# Altium schematic sheet ADC_RS_MCU.SchDoc
size A0; SheetNumber: 1; SheetTotal: 1
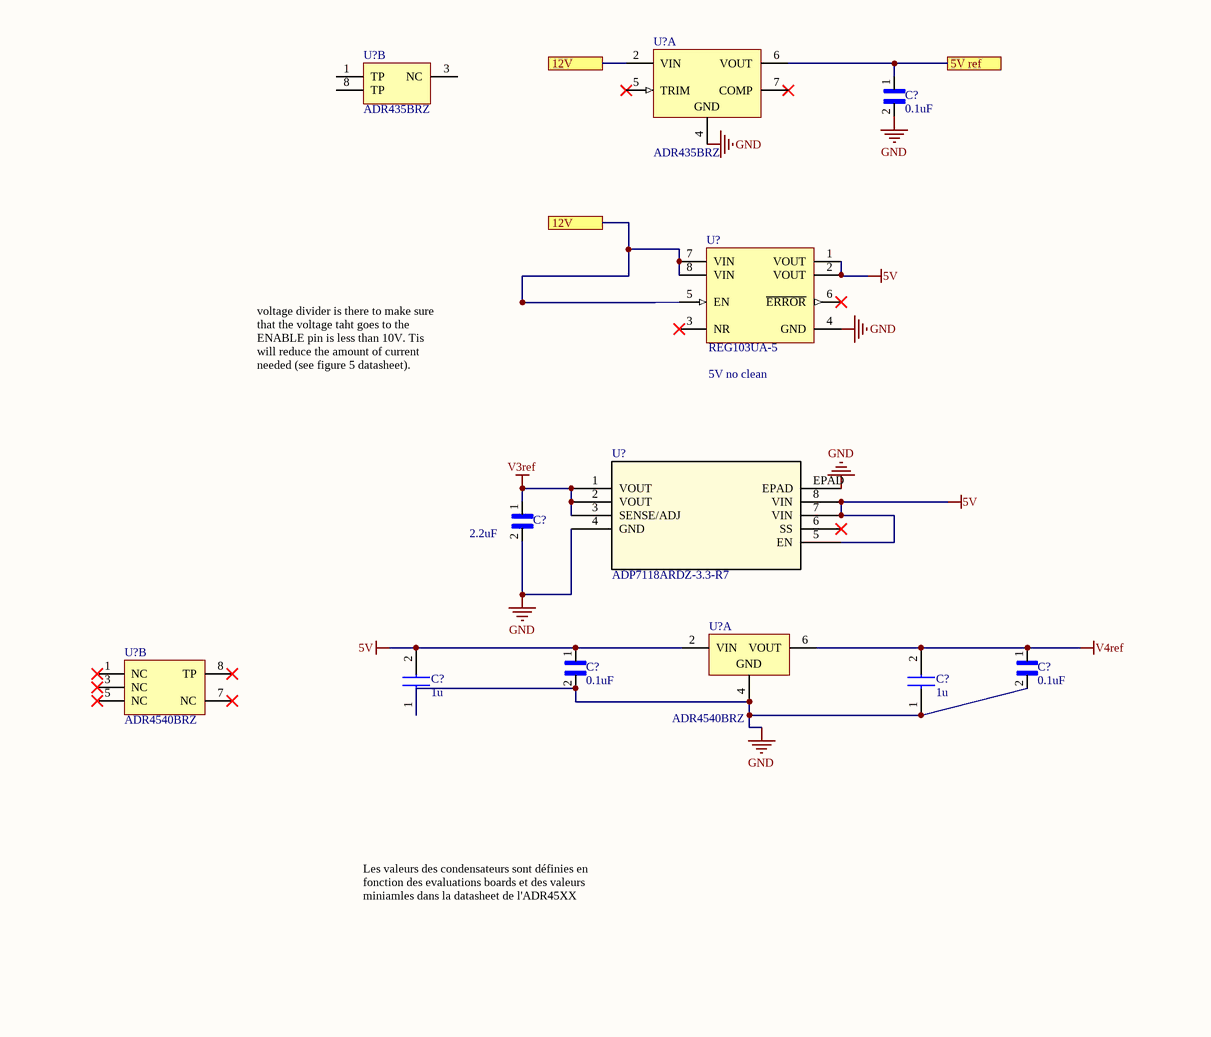
[diagram p0: ADC_RS_MCU.SchDoc, top left]
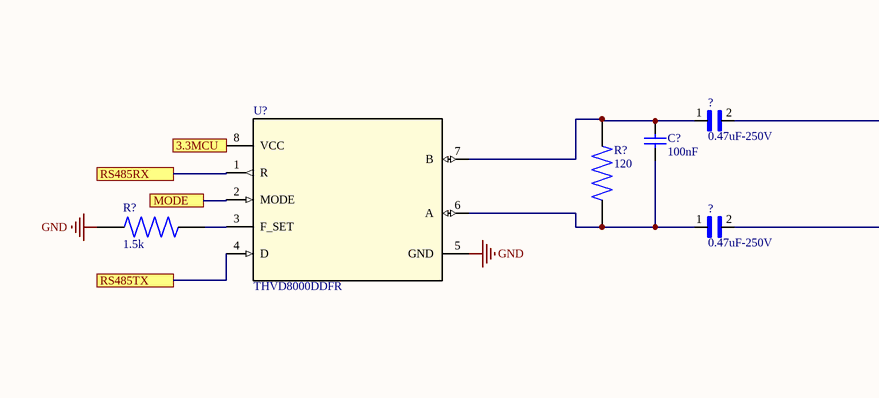
[diagram p1: ADC_RS_MCU.SchDoc, top middle]
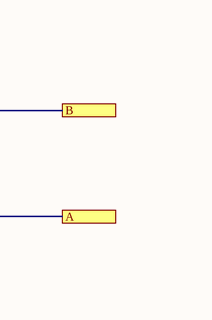
[diagram p2: ADC_RS_MCU.SchDoc, top right]
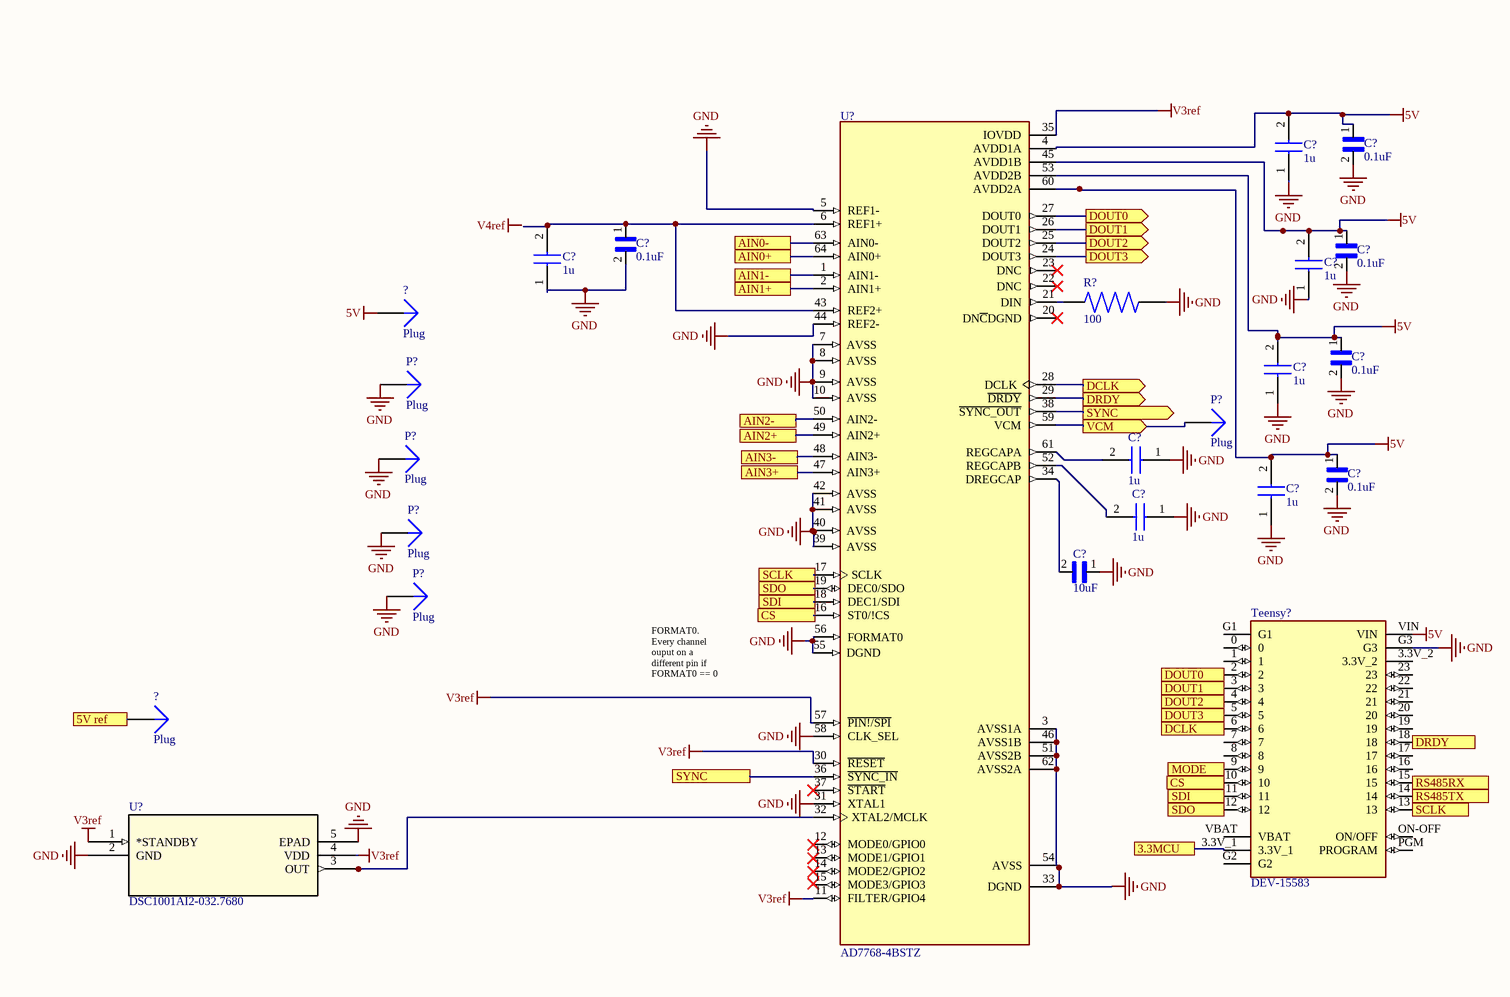
[diagram p3: ADC_RS_MCU.SchDoc, bottom left]
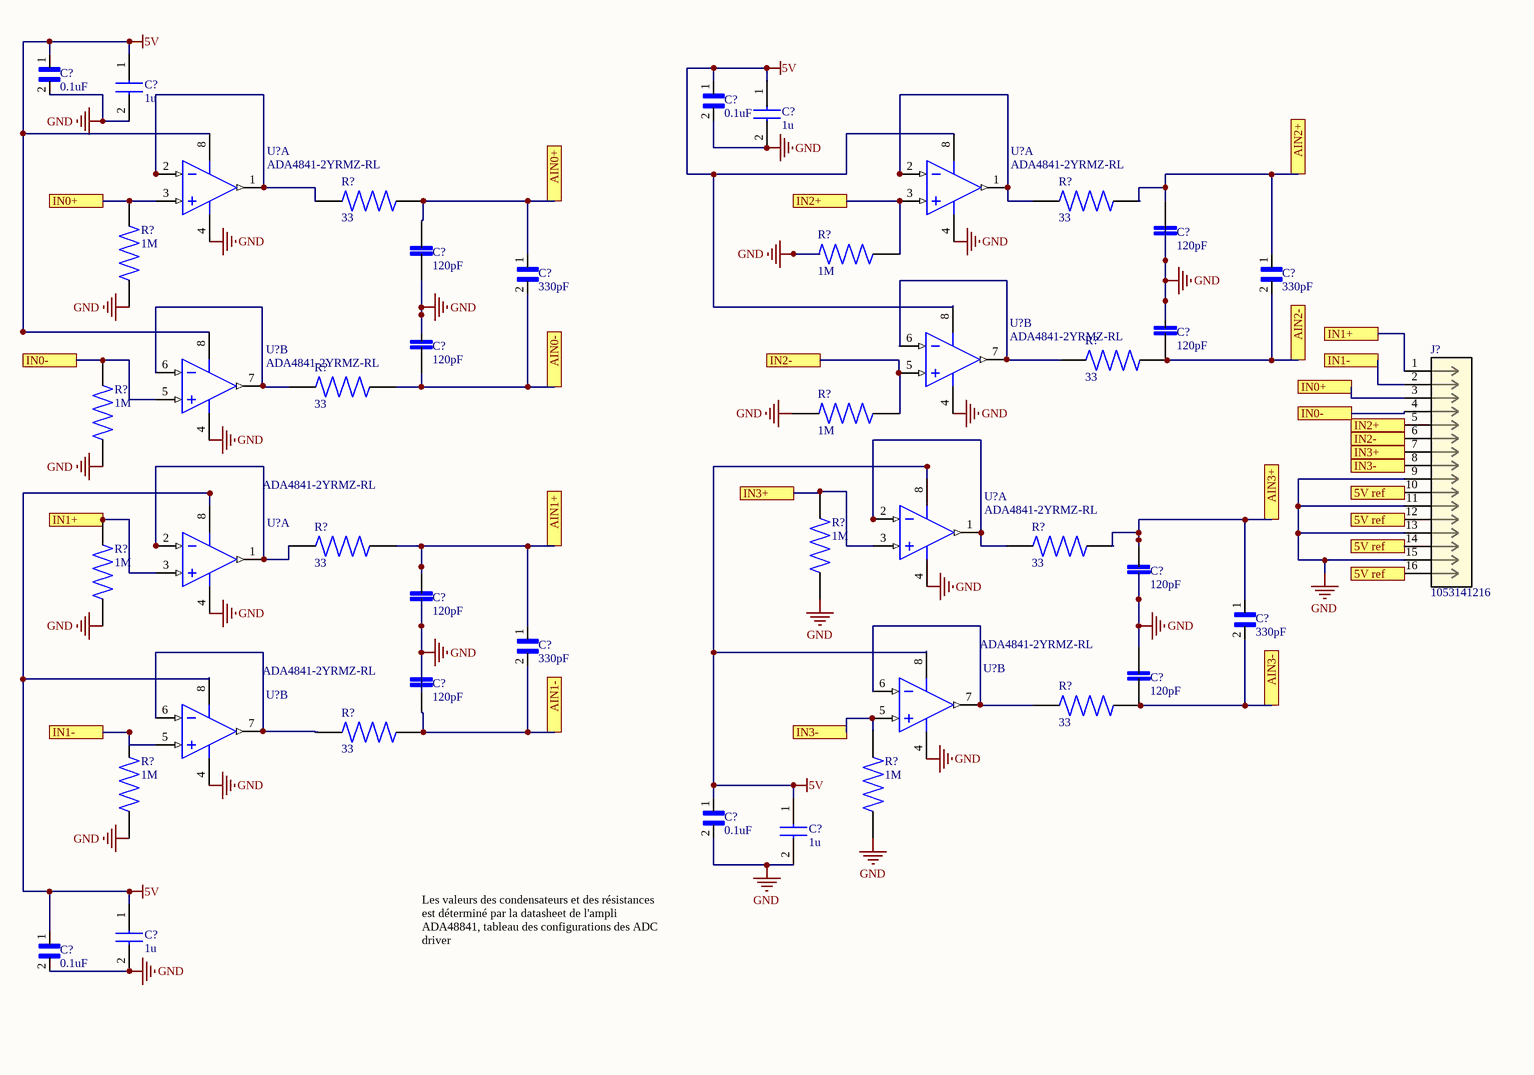
[diagram p4: ADC_RS_MCU.SchDoc, bottom right]

## Parts
(Parts that share a designator on the sheet are numbered #1, #2 ... from top to bottom, then left to right.)
?#1  0.47uF-250V  [CAPC3326X280N]
?#2  0.47uF-250V  [CAPC3326X280N]
?#3  Plug  [PIN1]
?#4  Plug  [PIN1]
C?#1  0.1uF  [CAPC1608X90N]
C?#2  100nF  [CAPC3216X94X50ML20T25]
C?#3  2.2uF  [CAPC1608X90]
C?#4  0.1uF  [CAPC1608X90N]
C?#5  0.1uF  [CAPC1608X90N]
C?#6  1u  [CAPC1608X90N]
C?#7  1u  [CAPC1608X90N]
C?#8  1u  [CAPC1608X90N]
C?#9  0.1uF  [CAPC1608X90N]
C?#10  1u  [CAPC1608X90N]
C?#11  0.1uF  [CAPC1608X90N]
C?#12  120pF  [CAPC1608X90]
C?#13  120pF  [CAPC1608X90]
C?#14  330pF  [CAPC1608X90]
C?#15  330pF  [CAPC1608X90]
C?#16  120pF  [CAPC1608X90]
C?#17  120pF  [CAPC1608X90]
C?#18  120pF  [CAPC1608X90]
C?#19  120pF  [CAPC1608X90]
C?#20  330pF  [CAPC1608X90]
C?#21  330pF  [CAPC1608X90]
C?#22  120pF  [CAPC1608X90]
C?#23  120pF  [CAPC1608X90]
C?#24  1u  [CAPC1608X90N]
C?#25  0.1uF  [CAPC1608X90N]
C?#26  0.1uF  [CAPC1608X90N]
C?#27  1u  [CAPC1608X90N]
C?#28  0.1uF  [CAPC1608X90N]
C?#29  1u  [CAPC1608X90N]
C?#30  0.1uF  [CAPC1608X90N]
C?#31  0.1uF  [CAPC1608X90N]
C?#32  1u  [CAPC1608X90N]
C?#33  1u  [CAPC1608X90N]
C?#34  0.1uF  [CAPC1608X90N]
C?#35  1u  [CAPC1608X90N]
C?#36  1u  [CAPC1608X90N]
C?#37  0.1uF  [CAPC1608X90N]
C?#38  1u  [CAPC1608X90N]
C?#39  1u  [CAPC1608X90N]
C?#40  10uF  [CAPC1608X9N]
J?  1053141216  [CON_1053141216]
P?#1  Plug  [PIN1]
P?#2  Plug  [PIN1]
P?#3  Plug  [PIN1]
P?#4  Plug  [PIN1]
P?#5  Plug  [PIN1]
R?#1  120  [RES_ERA3AEB121V]
R?#2  1.5k  [RESC1608X55N]
R?#3  33  [RESC1608X55N]
R?#4  33  [RESC1608X55N]
R?#5  1M  [RESC1608X55N]
R?#6  1M  [RESC1608X55N]
R?#7  33  [RESC1608X55N]
R?#8  33  [RESC1608X55N]
R?#9  1M  [RESC1608X55N]
R?#10  1M  [RESC1608X55N]
R?#11  33  [RESC1608X55N]
R?#12  1M  [RESC1608X55N]
R?#13  33  [RESC1608X55N]
R?#14  1M  [RESC1608X55N]
R?#15  33  [RESC1608X55N]
R?#16  33  [RESC1608X55N]
R?#17  1M  [RESC1608X55N]
R?#18  1M  [RESC1608X55N]
R?#19  100  [RESC1508X55N]
Teensy?  DEV-15583  [MODULE_DEV-15583]
U?#1  ADR435BRZ  [ADI-R-8_M]  (part A of 2)
U?#2  ADR435BRZ  [ADI-R-8_M]  (part B of 2)
U?#3  THVD8000DDFR  [DDF0008A-IPC_A]
U?#4  REG103UA-5  [D0008A_M]
U?#5  ADP7118ARDZ-3.3-R7  [SOIC_08_EP_3P9X4P9_ADI]
U?#6  ADR4540BRZ  [ADI-R-8_M]  (part A of 2)
U?#7  ADR4540BRZ  [ADI-R-8_M]  (part B of 2)
U?#8  ADA4841-2YRMZ-RL  [ADI-RM-8_M]  (part A of 2)
U?#9  ADA4841-2YRMZ-RL  [ADI-RM-8_M]  (part A of 2)
U?#10  ADA4841-2YRMZ-RL  [ADI-RM-8_M]  (part B of 2)
U?#11  ADA4841-2YRMZ-RL  [ADI-RM-8_M]  (part B of 2)
U?#12  ADA4841-2YRMZ-RL  [ADI-RM-8_M]  (part A of 2)
U?#13  ADA4841-2YRMZ-RL  [ADI-RM-8_M]  (part A of 2)
U?#14  ADA4841-2YRMZ-RL  [ADI-RM-8_M]  (part B of 2)
U?#15  ADA4841-2YRMZ-RL  [ADI-RM-8_M]  (part B of 2)
U?#16  AD7768-4BSTZ
U?#17  DSC1001AI2-032.7680  [DFN4_7X5_MCH]

## Ports
3.3MCU, 5V ref, 12V, A, AIN0+, AIN0-, AIN1+, AIN1-, AIN2+, AIN2-, AIN3+, AIN3-, B, CS, DCLK (out), DOUT0 (out), DOUT1 (out), DOUT2 (out), DOUT3 (out), DRDY (out), IN0+, IN0-, IN1+, IN1-, IN2+, IN2-, IN3+, IN3-, MODE, RS485RX, RS485TX, SCLK, SDI, SDO, SYNC, SYNC (out), VCM (out)

## Nets
5V: ?#3.1 C?#4.1 C?#6.2 C?#8.1 C?#9.1 C?#10.1 C?#11.1 C?#24.1 C?#25.1 C?#26.1 C?#27.2 C?#29.1 C?#30.1 C?#31.1 C?#33.2 C?#34.1 C?#35.2 C?#37.1 C?#39.2 Teensy?.VIN U?#4.1(VOUT) U?#4.2(VOUT) U?#5.5(EN) U?#5.7(VIN) U?#5.8(VIN) U?#6.2(VIN) U?#8.8(+VS) U?#9.8(+VS) U?#10.8(+VS) U?#11.8(+VS) U?#12.8(+VS) U?#13.8(+VS) U?#14.8(+VS) U?#15.8(+VS) U?#16.4(AVDD1A) U?#16.45(AVDD1B) U?#16.53(AVDD2B) U?#16.60(AVDD2A)
GND: C?#1.2 C?#3.2 C?#4.2 C?#5.2 C?#6.1 C?#7.1 C?#8.2 C?#9.2 C?#10.2 C?#11.2 C?#12.1 C?#13.1 C?#16.2 C?#17.2 C?#18.1 C?#19.1 C?#22.2 C?#23.2 C?#24.2 C?#25.2 C?#26.2 C?#27.1 C?#28.2 C?#29.2 C?#30.2 C?#31.2 C?#32.1 C?#33.1 C?#34.2 C?#35.1 C?#36.1 C?#37.2 C?#38.1 C?#39.1 C?#40.1 J?.9 J?.11 J?.13 J?.15 P?#1.1 P?#3.1 P?#4.1 P?#5.1 R?#2.1 R?#5.1 R?#6.2 R?#9.1 R?#10.2 R?#12.1 R?#14.1 R?#17.1 R?#18.1 R?#19.2 Teensy?.G3 U?#1.4(GND) U?#3.5(GND) U?#4.4(GND) U?#5.4(GND) U?#5.EPAD U?#6.4(GND) U?#8.4(-VS) U?#9.4(-VS) U?#10.4(-VS) U?#11.4(-VS) U?#12.4(-VS) U?#13.4(-VS) U?#14.4(-VS) U?#15.4(-VS) U?#16.3(AVSS1A) U?#16.5(REF1-) U?#16.7(AVSS) U?#16.8(AVSS) U?#16.9(AVSS) U?#16.10(AVSS) U?#16.31(XTAL1) U?#16.33(DGND) U?#16.39(AVSS) U?#16.40(AVSS) U?#16.41(AVSS) U?#16.42(AVSS) U?#16.44(REF2-) U?#16.46(AVSS1B) U?#16.51(AVSS2B) U?#16.54(AVSS) U?#16.55(DGND) U?#16.56(FORMAT0) U?#16.58(CLK_SEL) U?#16.62(AVSS2A) U?#17.2(GND) U?#17.5(EPAD)
V3ref: C?#3.1 U?#5.1(VOUT) U?#5.2(VOUT) U?#5.3(SENSE/ADJ) U?#16.11(FILTER/GPIO4) U?#16.30(~{RESET}) U?#16.35(IOVDD) U?#16.57(~{PIN!/SPI}) U?#17.1(*STANDBY) U?#17.4(VDD)
V4ref: C?#5.1 C?#7.2 U?#6.6(VOUT)
3.3MCU: Teensy?.3.3V_1 U?#3.8(VCC) ; port 3.3MCU
5V ref: ?#4.1 C?#1.1 J?.10 J?.12 J?.14 J?.16 U?#1.6(VOUT) ; port 5V ref
12V: U?#1.2(VIN) U?#4.5(EN) U?#4.7(VIN) U?#4.8(VIN) ; port 12V
A: ?#2.2 ; port A
AIN0+: C?#13.2 C?#14.1 R?#3.2 U?#16.64(AIN0+) ; port AIN0+
AIN0-: C?#14.2 C?#17.1 R?#8.2 U?#16.63(AIN0-) ; port AIN0-
AIN1+: C?#19.2 C?#21.1 R?#11.2 U?#16.2(AIN1+) ; port AIN1+
AIN1-: C?#21.2 C?#23.1 R?#16.2 U?#16.1(AIN1-) ; port AIN1-
AIN2+: C?#12.2 C?#15.1 R?#4.2 U?#16.49(AIN2+) ; port AIN2+
AIN2-: C?#15.2 C?#16.1 R?#7.2 U?#16.50(AIN2-) ; port AIN2-
AIN3+: C?#18.2 C?#20.1 R?#13.2 U?#16.47(AIN3+) ; port AIN3+
AIN3-: C?#20.2 C?#22.1 R?#15.2 U?#16.48(AIN3-) ; port AIN3-
B: ?#1.2 ; port B
CS: Teensy?.10 U?#16.16(ST0/!CS) ; port CS
DCLK: Teensy?.6 U?#16.28(DCLK) ; port DCLK
DOUT0: Teensy?.2 U?#16.27(DOUT0) ; port DOUT0
DOUT1: Teensy?.3 U?#16.26(DOUT1) ; port DOUT1
DOUT2: Teensy?.4 U?#16.25(DOUT2) ; port DOUT2
DOUT3: Teensy?.5 U?#16.24(DOUT3) ; port DOUT3
DRDY: Teensy?.18 U?#16.29(~{DRDY}) ; port DRDY
IN0+: J?.3 R?#5.2 U?#8.3(+IN_1) ; port IN0+
IN0-: J?.4 R?#9.2 U?#11.5(+IN_2) ; port IN0-
IN1+: J?.1 R?#14.2 U?#13.3(+IN_1) ; port IN1+
IN1-: J?.2 R?#17.2 U?#15.5(+IN_2) ; port IN1-
IN2+: J?.5 R?#6.1 U?#9.3(+IN_1) ; port IN2+
IN2-: J?.6 R?#10.1 U?#10.5(+IN_2) ; port IN2-
IN3+: J?.7 R?#12.2 U?#12.3(+IN_1) ; port IN3+
IN3-: J?.8 R?#18.2 U?#14.5(+IN_2) ; port IN3-
MODE: Teensy?.9 U?#3.2(MODE) ; port MODE
RS485RX: Teensy?.15 U?#3.1(R) ; port RS485RX
RS485TX: Teensy?.14 U?#3.4(D) ; port RS485TX
SCLK: Teensy?.13 U?#16.17(SCLK) ; port SCLK
SDI: Teensy?.11 U?#16.18(DEC1/SDI) ; port SDI
SDO: Teensy?.12 U?#16.19(DEC0/SDO) ; port SDO
SYNC: U?#16.36(~{SYNC_IN}) U?#16.38(~{SYNC_OUT}) ; port SYNC
VCM: P?#2.1 U?#16.59(VCM) ; port VCM
Net?#1_1: ?#1.1 C?#2.1 R?#1.2 U?#3.7(B)
Net?#2_1: ?#2.1 C?#2.2 R?#1.1 U?#3.6(A)
NetC?#28_1: C?#28.1 C?#32.2 U?#16.6(REF1+) U?#16.43(REF2+)
NetC?#36_2: C?#36.2 U?#16.61(REGCAPA)
NetC?#38_2: C?#38.2 U?#16.52(REGCAPB)
NetC?#40_2: C?#40.2 U?#16.34(DREGCAP)
NetR?#2_2: R?#2.2 U?#3.3(F_SET)
NetR?#3_1: R?#3.1 U?#8.1(OUT_1) U?#8.2(-IN_1)
NetR?#4_1: R?#4.1 U?#9.1(OUT_1) U?#9.2(-IN_1)
NetR?#7_1: R?#7.1 U?#10.6(-IN_2) U?#10.7(OUT_2)
NetR?#8_1: R?#8.1 U?#11.6(-IN_2) U?#11.7(OUT_2)
NetR?#11_1: R?#11.1 U?#13.1(OUT_1) U?#13.2(-IN_1)
NetR?#13_1: R?#13.1 U?#12.1(OUT_1) U?#12.2(-IN_1)
NetR?#15_1: R?#15.1 U?#14.6(-IN_2) U?#14.7(OUT_2)
NetR?#16_1: R?#16.1 U?#15.6(-IN_2) U?#15.7(OUT_2)
NetR?#19_1: R?#19.1 U?#16.21(DIN)
NetU?#16_32: U?#16.32(XTAL2/MCLK) U?#17.3(OUT)

Not connected (* = marked no-connect by the designer): Teensy? 0 1 3.3V_2 7 8 16 17 19 20 21 22 23 G1 G2 ON-OFF(ON/OFF) PGM(PROGRAM) VBAT; U?#1 5(TRIM)* 7(COMP)*; U?#2 1(TP) 3(NC) 8(TP); U?#4 3(NR)* 6(~{ERROR})*; U?#5 6(SS)*; U?#7 1(NC)* 3(NC)* 5(NC)* 7(NC)* 8(TP)*; U?#16 12(MODE0/GPIO0)* 13(MODE1/GPIO1)* 14(MODE2/GPIO2)* 15(MODE3/GPIO3) 20(DN~{C}DGND)* 22(DNC)* 23(DNC)* 37(~{START})*

## Notes on the sheet
- voltage divider is there to make sure that the voltage taht goes to the ENABLE pin is less than 10V. Tis will reduce the amount of current needed (see figure 5 datasheet).
- (near U?#4) 5V no clean
- Les valeurs des condensateurs sont définies en fonction des evaluations boards et des valeurs miniamles dans la datasheet de l'ADR45XX
- Les valeurs des condensateurs et des résistances est déterminé par la datasheet de l'ampli ADA48841, tableau des configurations des ADC driver
- FORMAT0. Every channel ouput on a different pin if FORMAT0 == 0
- Labels drawn without touching a wire or pin: V4ref

## Library data of the parts
?#1 ?#2 = CMP-010-000002-1: MF: {'manufacturer': u'KEMET'}; MP: C1210X474KARACAUTO; Value: *; Package: None; Price: None; Availability: Unavailable; Component Type: Standard; Design Item ID: C1210X474KARACAUTO; Pin Count: 2; Source: workerBoard.SCHLIB
?#3 ?#4 P?#1-P?#5 = CMP-010-000007-1: Signal Integrity: Connector; LatestRevisionDate: 17-Jul-2002; LatestRevisionNote: Re-released for DXP Platform.; Publisher: Altium Limited; Component Type: Standard; Design Item ID: Plug; Pin Count: 1; Source: workerBoard.SCHLIB
C?#1 C?#4 C?#5 C?#9 C?#11 C?#25 C?#26 C?#28 C?#30 C?#31 C?#34 C?#37 = CMP-003-000001-1: Cap Ceramic 0.1uF 25V X5R 10% SMD 0603 85ÂÂŽ T/R; MF: {'manufacturer': u'AVX'}; Price: None; Availability: Unavailable; Value: *; MP: 06033D104KAT2A; Package: None; Component Type: Standard; Design Item ID: 06033D104KAT2A; Pin Count: 2; Source: workerBoard.SCHLIB
C?#2 = CMP-003-000005-1: Chip Capacitor, Ceramic, 100 nF, 10%, 50 V, 1206, RoHS, Tape and Reel; Manufacturer: Kyocera AVX; Manufacturer Part Number: 12065C104KAT2A; Rated Voltage: 50V; Dielectric: X7R; Datasheet URL: http://www.mouser.com/ds/2/40/cauto-360.pdf; Capacitance: 100nF; Manufacturer URL: http://www.avx.com/; Datasheet Version: Sep-14; Tolerance (%): ±10%; Case Size/Dimension: 1206; Component Type: Standard; Design Item ID: CMP-2000-05018-1; Pin Count: 2; Source: workerBoard.SCHLIB
C?#3 = CMP-003-000006-1: 2.2UF 16V 20%; MP: F981C225MMA; MF: {'manufacturer': u'AVX'}; Package: None; Availability: Unavailable; Value: *; Price: None; Component Type: Standard; Design Item ID: F981C225MMA; Pin Count: 2; Source: workerBoard.SCHLIB
C?#6-C?#8 C?#10 C?#24 C?#27 C?#29 C?#32 C?#33 C?#35 C?#36 C?#38 C?#39 = CMP-003-000003-1: Capacitor; Manufacturer_Name: AVX; Datasheet Link: https://componentsearchengine.com/Datasheets/1/06031A100FAT2A.pdf; Height: 0.9mm; Manufacturer_Part_Number: 0603YC105MAT4A; Component Type: Standard; Design Item ID: 0603YC105MAT4A; Pin Count: 2; Source: workerBoard.SCHLIB
C?#12 C?#13 C?#16-C?#19 C?#22 C?#23 = CMP-003-000002-1: 0603 120 pF 50 V Â±2 % Tolerance C0G/NP0 SMT Multilayer Ceramic Capacitor; MF: {'manufacturer': u'AVX'}; Price: None; Availability: Unavailable; Value: *; MP: 06035A121GAT2A; Package: None; Component Type: Standard; Design Item ID: 06035A121GAT2A; Pin Count: 2; Source: workerBoard.SCHLIB
C?#14 C?#15 C?#20 C?#21 = CMP-003-000000-1: 0603 SMD Ceramic Capacitors 0603 330pF 25volts C0G 2%; MP: 06033A331GAT2A; MF: {'manufacturer': u'AVX'}; Price: None; Availability: Unavailable; Value: *; Package: None; Component Type: Standard; Design Item ID: 06033A331GAT2A; Pin Count: 2; Source: workerBoard.SCHLIB
C?#40 = CMP-003-000008-1: CAP CER 10UF 10V X5R 0603; MP: GRT188R61A106ME13D; MF: {'manufacturer': u'Murata'}; Price: None; Availability: Unavailable; Value: *; Package: None; Component Type: Standard; Design Item ID: GRT188R61A106ME13D; Pin Count: 2; Source: workerBoard.SCHLIB
J? = CMP-010-000000-1: No Description Available; Mfr_Name: Molex Connector Corporation; Copyright: Copyright (C) 2021 Ultra Librarian. All rights reserved.; Manufacturer_Part_Number: 1053141216; Digi-Key_Part_Number_1: WM15165-ND; RefDes: RefDes; Type: DEV; Component Type: Standard; Design Item ID: 1053141216; Pin Count: 16; Source: workerBoard.SCHLIB
R?#1 = CMP-008-000000-1: MP: ERA3AEB121V; MF: {'manufacturer': u'Panasonic'}; Price: None; Availability: Unavailable; Value: *; Package: None; Component Type: Standard; Design Item ID: ERA3AEB121V; Pin Count: 2; Source: workerBoard.SCHLIB
R?#2 = CMP-008-000003-1: MP: RT0603BRD071K5L; MF: {'manufacturer': u'Yageo'}; Price: None; Availability: Unavailable; Value: *; Package: None; Component Type: Standard; Design Item ID: RT0603BRD071K5L; Pin Count: 2; Source: workerBoard.SCHLIB
R?#3 R?#4 R?#7 R?#8 R?#11 R?#13 R?#15 R?#16 = CMP-008-000006-1: RES SMD 33 OHM 0.1% 1/10W 0603; MP: RT0603BRD0733RL; MF: {'manufacturer': u'Yageo'}; Price: None; Availability: Unavailable; Value: *; Package: None; Component Type: Standard; Design Item ID: RT0603BRD0733RL_2; Pin Count: 2; Source: workerBoard.SCHLIB
R?#5 R?#6 R?#9 R?#10 R?#12 R?#14 R?#17 R?#18 = CMP-008-000007-1: MP: RT0603DRD071ML; MF: {'manufacturer': u'Yageo'}; Price: None; Availability: Unavailable; Value: *; Package: None; Component Type: Standard; Design Item ID: RT0603DRD071ML; Pin Count: 2; Source: workerBoard.SCHLIB
R?#19 = CMP-008-000002-1: MP: MCT0603MD1000DP500; MF: {'manufacturer': u'Vishay'}; Price: None; Availability: Unavailable; Value: *; Package: None; Component Type: Standard; Design Item ID: MCT0603MD1000DP500; Pin Count: 2; Source: workerBoard.SCHLIB
Teensy? = CMP-010-000005-1: RT1062 Teensy 4.0 i.MX ARMÂ® CortexÂ®-M7 MPU Embedded Evaluation Board; MF: SparkFun Electronics; Value: *; Package: None; Digi-Key_Part_Number: 1568-DEV-15583-ND; Digi-Key_Purchase_URL: https://www.digikey.com/product-detail/en/sparkfun-electronics/DEV-15583/1568-DEV-15583-ND/10384551?utm_source=snapeda&utm_medium=aggregator&utm_campaign=symbol; MP: DEV-15583; SnapEDA_Link: https://www.snapeda.com/parts/DEV-15583/SparkFun%20Electronics/view-part/4001229/?ref=snap; Component Type: Standard; Design Item ID: DEV-15583; Pin Count: 33; Source: workerBoard.SCHLIB
U?#1 U?#2 = CMP-006-000001-1: Ultralow Noise XFET Voltage Reference with Current Sink and Source Capability, 5 V Output, 7 to 18 V Supply, Industrial, 8-pin SOIC (R-8), Tube; Manufacturer: Analog Devices; Max V Supply (V): 18; Vout: 5V; Ref Out TC (ppm/C): 1; Min V Supply (V): 7; ComponentLink4Description: URL Link1; ComponentLink3Description: Package Specification; Mounting Technology: Surface Mount; DatasheetVersion: Rev. J; PackageDescription: 8-Pin Standard Small Outline Package, Body 4.9 x 3.9 mm, Pitch 1.27 mm; Packing: Tube; PackageVersion: 060506-A, 06/2006; PackageReference: R-8; ComponentLink2Description: Datasheet; PartNumber: ADR435BRZ; ComponentLink3URL: http://www.analog.com/static/imported-files/packages/PKG_PDF/SOIC_Narrow%20(R)/R_8.pdf; ComponentLink1Description: Manufacturer URL; ComponentLink2URL: http://www.analog.com/static/imported-files/data_sheets/ADR430_431_433_434_435_439.pdf; Operating Temp Range: -40 to 125 degC; Code_JEDEC: MS-012-AA; ComponentLink4URL: Product URL:http://www.analog.com/en/special-linear-functions/voltage-references/adr435/products/product.html; ComponentLink1URL: http://www.analog.com/en/index.html; Component Type: Standard; Design Item ID: CMP-0784-00226-1; Manufacturer Part Number: ADR435BRZ; Pin Count: 8; Source: workerBoard.SCHLIB
U?#3 = CMP-010-000008-1: No Description Available; Mfr_Name: Texas Instruments; Type: DEV; RefDes: RefDes; Copyright: Copyright (C) 2021 Ultra Librarian. All rights reserved.; Manufacturer_Part_Number: THVD8000DDFR; Component Type: Standard; Design Item ID: THVD8000DDFR; Pin Count: 8; Source: workerBoard.SCHLIB
U?#4 = CMP-010-000004-1: Single Output Fast Transient Response LDO, 500 mA, Fixed 5 V Output, 2.1 to 15 V Input, 8-pin SOIC (D), -55 to 125 degC, Green (RoHS & no Sb/Br); Manufacturer: Texas Instruments; Vdo(Typ)(mV): 160; Accuracy(%): 2; Iq(Typ)(mA): 0.5; Vin(Max)(V): 15; Power Good: TRUE; SubFamily: Single Channel LDO; Vout Adj(Max)(V): 5; Vin(Min)(V): 2.1; Mounting Technology: Surface Mount; ComponentLink1URL: http://www.ti.com/; PackageReference: D0008A; ComponentLink1Description: Manufacturer URL; Eco-Plan: Green (RoHS & no Sb/Br); PackageVersion: 4040047-3/M; PartNumber: REG103UA-5; Code_JEDEC: MS-012; DatasheetVersion: SBVS010D; ComponentLink2Description: Datasheet; PackageDescription: 8-Pin Plastic Small Outline, Body 4.9 x 3.9 mm, Pitch 1.27 mm; ComponentLink2URL: http://www.ti.com/general/docs/lit/getliterature.tsp?genericPartNumber=REG103-5&fileType=pdf; ComponentLink3URL: http://www.ti.com/litv/pdf/msoi002j; Fixed Output Options(V): 5; Iout(Max)(A): 0.5; Vout Adj(Min)(V): 5; ComponentLink3Description: Package Specification; Component Type: Standard; Design Item ID: CMP-0395-00135-2; Manufacturer Part Number: REG103UA-5; Pin Count: 8; Source: workerBoard.SCHLIB
U?#5 = CMP-010-000001-1: No Description Available; Mfr_Name: Analog Devices Inc; Copyright: Copyright (C) 2021 Ultra Librarian. All rights reserved.; Manufacturer_Part_Number: ADP7118ARDZ-3.3-R7; RefDes: RefDes; Type: DEV; Component Type: Standard; Design Item ID: ADP7118ARDZ-3.3-R7; Pin Count: 9; Source: workerBoard.SCHLIB
U?#6 U?#7 = CMP-006-000000-1: Ultralow Noise, High Accuracy Voltage Reference, 4.096 V Output, 3 to 15 V Supply, Industrial, 8-pin SOIC (R-8), Tube; Manufacturer: Analog Devices; Max V Supply (V): 15; Min V Supply (V): 3; Vout: 4.096V; Ref Out TC (ppm/C): 2; ComponentLink4URL: Product URL:http://www.analog.com/en/special-linear-functions/voltage-references/adr4540/products/product.html; Mounting Technology: Surface Mount; ComponentLink1Description: Manufacturer URL; PackageDescription: 8-Pin Standard Small Outline Package, Body 4.9 x 3.9 mm, Pitch 1.27 mm; ComponentLink2URL: http://www.analog.com/static/imported-files/data_sheets/ADR4520_4525_4530_4533_4540_4550.pdf; ComponentLink1URL: http://www.analog.com/en/index.html; DatasheetVersion: Rev. 0; ComponentLink4Description: URL Link1; Operating Temp Range: -40 to 125 degC; PartNumber: ADR4540BRZ; ComponentLink2Description: Datasheet; ComponentLink3URL: http://www.analog.com/static/imported-files/packages/PKG_PDF/SOIC_Narrow%20(R)/R_8.pdf; ComponentLink3Description: Package Specification; PackageVersion: 060506-A, 06/2006; Packing: Tube; PackageReference: R-8; Code_JEDEC: MS-012-AA; Component Type: Standard; Design Item ID: CMP-0784-00192-1; Manufacturer Part Number: ADR4540BRZ; Pin Count: 8; Source: workerBoard.SCHLIB
U?#8-U?#15 = CMP-007-000000-1: Double Channel Low Wide Band Noise Operational Amplifier, 80 MHz BW, 13 V/us SR, Industrial, 8-pin SOP (RM-8), Reel; Manufacturer: Analog Devices; Slew Rate: 13V/us; Iq/Amp: 1.5mA; Amplifiers Per Package: 2; Small Signal Bandwidth: 80MHz; V Span Min: 2.7V; V Span Max: 12V; Input Offset Voltage: 40uV; Input Bias Current: 3uA; ComponentLink3URL: http://www.analog.com/static/imported-files/packages/PKG_PDF/MSOP%28RM%29/RM_8.pdf; PartNumber: ADA4841-2YRMZ-RL; Mounting Technology: Surface Mount; DatasheetVersion: Rev. E; PackageDescription: 8-Pin Mini Small Outline Package, Body 3 x 3 mm, Pitch 0.65 mm; PackageReference: RM-8; ComponentLink2URL: http://www.analog.com/static/imported-files/data_sheets/ADA4841-1_4841-2.pdf; ComponentLink1Description: Manufacturer URL; ComponentLink2Description: Datasheet; Generic Part Number: ADA4841-2; ComponentLink1URL: http://www.analog.com/en/index.html; Code_JEDEC: MO-187-AA; ComponentLink3Description: Package Specification; Component Type: Standard; Design Item ID: CMP-0384-01677-1; Manufacturer Part Number: ADA4841-2YRMZ-RL; Pin Count: 8; Source: workerBoard.SCHLIB
U?#16 = CMP-005-000000-1: 24 Bit Analog to Digital Converter 4 Input 4 Sigma-Delta 64-LQFP _10x10_; MF: Analog Devices; Digi-Key_Purchase_URL: https://www.digikey.com/product-detail/en/analog-devices-inc/AD7768-4BSTZ/AD7768-4BSTZ-ND/6072260?utm_source=snapeda&utm_medium=aggregator&utm_campaign=symbol; Package: LQFP -64 Analog Devices; SnapEDA_Link: https://www.snapeda.com/parts/AD7768-4BSTZ/Analog%20Devices%20Inc./view-part/501603/?ref=snap; Value: *; MP: AD7768-4BSTZ; Digi-Key_Part_Number: AD7768-4BSTZ-ND; Component Type: Standard; Design Item ID: AD7768-4BSTZ; Pin Count: 64; Source: workerBoard.SCHLIB
U?#17 = CMP-010-000006-1: No Description Available; Mfr_Name: Microchip; Copyright: Copyright (C) 2021 Ultra Librarian. All rights reserved.; Manufacturer_Part_Number: DSC1001AI2-032.7680; Digi-Key_Part_Number_1: DSC1001AI2-032.7680-ND; RefDes: RefDes; Type: DEV; Component Type: Standard; Design Item ID: DSC1001AI2-032.7680; Pin Count: 5; Source: workerBoard.SCHLIB